# Altium schematic sheet Relays.SchDoc
size A4; SheetNumber: 4; SheetTotal: 4
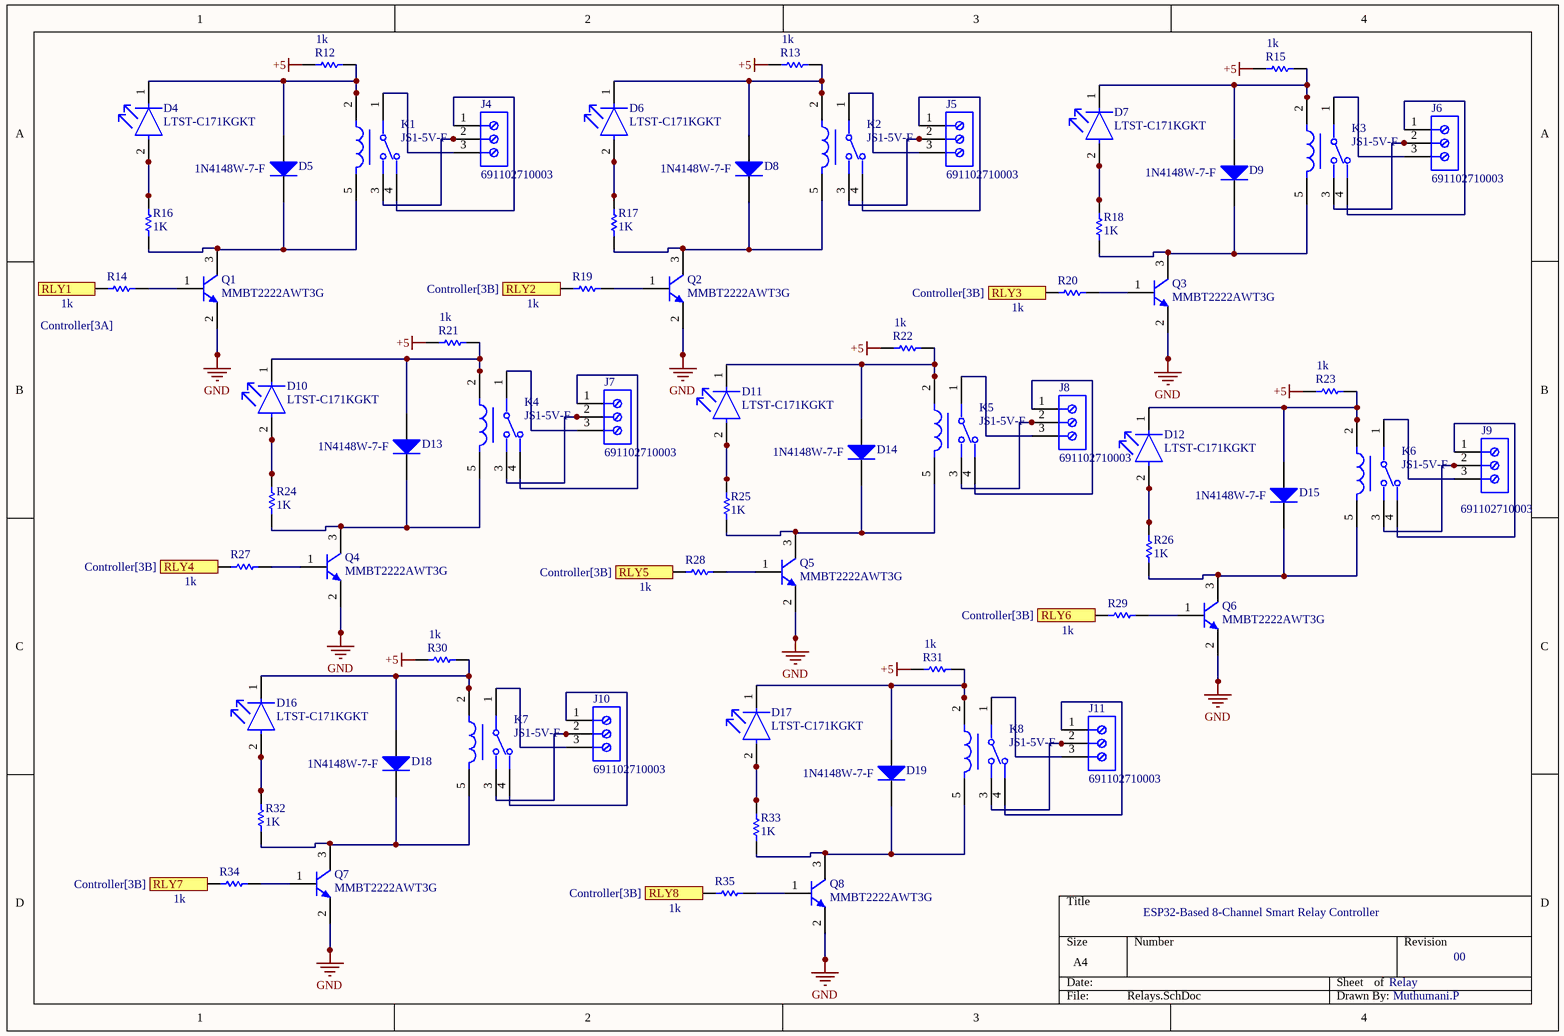
[diagram p0: Relays.SchDoc]

## Parts
D4  LTST-C171KGKT  [FP-LTST-C171KGKT-MFG]
D5  1N4148W-7-F  [DIOD-SOD123-2_V]
D6  LTST-C171KGKT  [FP-LTST-C171KGKT-MFG]
D7  LTST-C171KGKT  [FP-LTST-C171KGKT-MFG]
D8  1N4148W-7-F  [DIOD-SOD123-2_V]
D9  1N4148W-7-F  [DIOD-SOD123-2_V]
D10  LTST-C171KGKT  [FP-LTST-C171KGKT-MFG]
D11  LTST-C171KGKT  [FP-LTST-C171KGKT-MFG]
D12  LTST-C171KGKT  [FP-LTST-C171KGKT-MFG]
D13  1N4148W-7-F  [DIOD-SOD123-2_V]
D14  1N4148W-7-F  [DIOD-SOD123-2_V]
D15  1N4148W-7-F  [DIOD-SOD123-2_V]
D16  LTST-C171KGKT  [FP-LTST-C171KGKT-MFG]
D17  LTST-C171KGKT  [FP-LTST-C171KGKT-MFG]
D18  1N4148W-7-F  [DIOD-SOD123-2_V]
D19  1N4148W-7-F  [DIOD-SOD123-2_V]
J4  691102710003  [691102710003]
J5  691102710003  [691102710003]
J6  691102710003  [691102710003]
J7  691102710003  [691102710003]
J8  691102710003  [691102710003]
J9  691102710003  [691102710003]
J10  691102710003  [691102710003]
J11  691102710003  [691102710003]
K1  JS1-5V-F  [FP-JS1-5V-F-MFG]
K2  JS1-5V-F  [FP-JS1-5V-F-MFG]
K3  JS1-5V-F  [FP-JS1-5V-F-MFG]
K4  JS1-5V-F  [FP-JS1-5V-F-MFG]
K5  JS1-5V-F  [FP-JS1-5V-F-MFG]
K6  JS1-5V-F  [FP-JS1-5V-F-MFG]
K7  JS1-5V-F  [FP-JS1-5V-F-MFG]
K8  JS1-5V-F  [FP-JS1-5V-F-MFG]
Q1  MMBT2222AWT3G  [ONSC-SC-70-3-419-04_V]
Q2  MMBT2222AWT3G  [ONSC-SC-70-3-419-04_V]
Q3  MMBT2222AWT3G  [ONSC-SC-70-3-419-04_V]
Q4  MMBT2222AWT3G  [ONSC-SC-70-3-419-04_V]
Q5  MMBT2222AWT3G  [ONSC-SC-70-3-419-04_V]
Q6  MMBT2222AWT3G  [ONSC-SC-70-3-419-04_V]
Q7  MMBT2222AWT3G  [ONSC-SC-70-3-419-04_V]
Q8  MMBT2222AWT3G  [ONSC-SC-70-3-419-04_V]
R12  1k  [RESC2013X60X35ML10T20]
R13  1k  [RESC2013X60X35ML10T20]
R14  1k  [RESC2013X60X35ML10T20]
R15  1k  [RESC2013X60X35ML10T20]
R16  1K  [RESC2013X60X35ML10T20]
R17  1K  [RESC2013X60X35ML10T20]
R18  1K  [RESC2013X60X35ML10T20]
R19  1k  [RESC2013X60X35ML10T20]
R20  1k  [RESC2013X60X35ML10T20]
R21  1k  [RESC2013X60X35ML10T20]
R22  1k  [RESC2013X60X35ML10T20]
R23  1k  [RESC2013X60X35ML10T20]
R24  1K  [RESC2013X60X35ML10T20]
R25  1K  [RESC2013X60X35ML10T20]
R26  1K  [RESC2013X60X35ML10T20]
R27  1k  [RESC2013X60X35ML10T20]
R28  1k  [RESC2013X60X35ML10T20]
R29  1k  [RESC2013X60X35ML10T20]
R30  1k  [RESC2013X60X35ML10T20]
R31  1k  [RESC2013X60X35ML10T20]
R32  1K  [RESC2013X60X35ML10T20]
R33  1K  [RESC2013X60X35ML10T20]
R34  1k  [RESC2013X60X35ML10T20]
R35  1k  [RESC2013X60X35ML10T20]

## Ports
RLY1 (see Controller[3A]), RLY2 (see Controller[3B]), RLY3 (see Controller[3B]), RLY4 (see Controller[3B]), RLY5 (see Controller[3B]), RLY6 (see Controller[3B]), RLY7 (see Controller[3B]), RLY8 (see Controller[3B])

## Nets
+5: R12.2 R13.2 R15.2 R21.2 R22.2 R23.2 R30.2 R31.2
GND: Q1.2(E) Q2.2(E) Q3.2(E) Q4.2(E) Q5.2(E) Q6.2(E) Q7.2(E) Q8.2(E)
RLY1: R14.1 ; port RLY1
RLY2: R19.1 ; port RLY2
RLY3: R20.1 ; port RLY3
RLY4: R27.1 ; port RLY4
RLY5: R28.1 ; port RLY5
RLY6: R29.1 ; port RLY6
RLY7: R34.1 ; port RLY7
RLY8: R35.1 ; port RLY8
NetD4_1: D4.1(C) D5.1(A) K1.2(1_COIL) R12.1
NetD4_2: D4.2(A) R16.2
NetD5_2: D5.2(K) K1.5(2_COIL) Q1.3(C) R16.1
NetD6_1: D6.1(C) D8.1(A) K2.2(1_COIL) R13.1
NetD6_2: D6.2(A) R17.2
NetD7_1: D7.1(C) D9.1(A) K3.2(1_COIL) R15.1
NetD7_2: D7.2(A) R18.2
NetD8_2: D8.2(K) K2.5(2_COIL) Q2.3(C) R17.1
NetD9_2: D9.2(K) K3.5(2_COIL) Q3.3(C) R18.1
NetD10_1: D10.1(C) D13.1(A) K4.2(1_COIL) R21.1
NetD10_2: D10.2(A) R24.2
NetD11_1: D11.1(C) D14.1(A) K5.2(1_COIL) R22.1
NetD11_2: D11.2(A) R25.2
NetD12_1: D12.1(C) D15.1(A) K6.2(1_COIL) R23.1
NetD12_2: D12.2(A) R26.2
NetD13_2: D13.2(K) K4.5(2_COIL) Q4.3(C) R24.1
NetD14_2: D14.2(K) K5.5(2_COIL) Q5.3(C) R25.1
NetD15_2: D15.2(K) K6.5(2_COIL) Q6.3(C) R26.1
NetD16_1: D16.1(C) D18.1(A) K7.2(1_COIL) R30.1
NetD16_2: D16.2(A) R32.2
NetD17_1: D17.1(C) D19.1(A) K8.2(1_COIL) R31.1
NetD17_2: D17.2(A) R33.2
NetD18_2: D18.2(K) K7.5(2_COIL) Q7.3(C) R32.1
NetD19_2: D19.2(K) K8.5(2_COIL) Q8.3(C) R33.1
NetJ4_1: J4.1 K1.4(N.C.)
NetJ4_2: J4.2 K1.3(N.O.)
NetJ4_3: J4.3 K1.1(COM)
NetJ5_1: J5.1 K2.4(N.C.)
NetJ5_2: J5.2 K2.3(N.O.)
NetJ5_3: J5.3 K2.1(COM)
NetJ6_1: J6.1 K3.4(N.C.)
NetJ6_2: J6.2 K3.3(N.O.)
NetJ6_3: J6.3 K3.1(COM)
NetJ7_1: J7.1 K4.4(N.C.)
NetJ7_2: J7.2 K4.3(N.O.)
NetJ7_3: J7.3 K4.1(COM)
NetJ8_1: J8.1 K5.4(N.C.)
NetJ8_2: J8.2 K5.3(N.O.)
NetJ8_3: J8.3 K5.1(COM)
NetJ9_1: J9.1 K6.4(N.C.)
NetJ9_2: J9.2 K6.3(N.O.)
NetJ9_3: J9.3 K6.1(COM)
NetJ10_1: J10.1 K7.4(N.C.)
NetJ10_2: J10.2 K7.3(N.O.)
NetJ10_3: J10.3 K7.1(COM)
NetJ11_1: J11.1 K8.4(N.C.)
NetJ11_2: J11.2 K8.3(N.O.)
NetJ11_3: J11.3 K8.1(COM)
NetQ1_1: Q1.1(B) R14.2
NetQ2_1: Q2.1(B) R19.2
NetQ3_1: Q3.1(B) R20.2
NetQ4_1: Q4.1(B) R27.2
NetQ5_1: Q5.1(B) R28.2
NetQ6_1: Q6.1(B) R29.2
NetQ7_1: Q7.1(B) R34.2
NetQ8_1: Q8.1(B) R35.2

## Notes on the sheet
- ESP32-Based 8-Channel Smart Relay Controller
- Relay
- 00
- Muthumani.P

## Library data of the parts
D4 D6 D7 D10-D12 D16 D17 = CMP-22017-000037-1: LED GREEN CLEAR SMD; Number of LEDs: 1; Viewing Angle: 130°; Lens Style: Rectangular; Dominant Wavelength: 571nm; Test Current: 20mA; Luminous Intensity: 35mcd; Power Rating: 75mW; Forward Voltage: 2.4V; Forward Current: 30mA; Reverse Voltage: 5V; Lens Color: Colorless; Wavelength: 574nm; Height: 0.8mm; Illumination Color: Green; Length: 2mm; Case/Package: 0805; Number of Pins: 2; Number of Elements: 1; Package Quantity: 1; Depth: 1.25mm; Lens Transparency: Clear; Width: 1.25mm; Color: Green; Radiation Hardening: No; Mount: Surface Mount; Packaging: Tape and Reel; Case Code (Metric): 2012; Lead Free: Lead Free; Max Operating Temperature: 85°C; Min Operating Temperature: -55°C; Case Code (Imperial): 0805; Power Dissipation: 75mW
D5 D8 D9 D13-D15 D18 D19 = CMP-2000-04932-2: Fast Switching Diode, 100 V, 0.15 A, -65 to 150 degC, 2-Pin?SOD123, RoHS, Tape and Reel; Recovery Time: 4ns; Brand: DiodesIncorporated; Unit Weight: 0.000353oz; Max Surge Current: 2A; Peak Reverse Voltage: 100V; Ir - Reverse Current: 1uA; Vf - Forward Voltage: 1.25V; Configuration: Single; If - Forward Current: 0.15A; Product Category: Diodes-GeneralPurpose,Power,Switching; Operating Temperature Range: -65Cto+150C; Packaging: Reel; Manufacturer URL: http://www.diodes.com/; Maximum Operating Temperature: +150C; Height: 1.25mm; Minimum Operating Temperature: -65C; Product: SwitchingDiodes; Package URL: http://www.diodes.com/datasheets/ds18004.pdf; Type: SwitchingDiode; Package Reference: SOD123-2; Width: 1.7mm; Datasheet URL: http://www.farnell.com/datasheets/1915529.pdf; Datasheet Version: Rev. 24-2, 10/2013; Series: 1N4148; Factory Pack Quantity: 3000; Length: 2.85mm; RoHS: True; Manufacturer: DiodesIncorporated; Mounting Style: SMD/SMT; Package / Case: SOD-123
J4-J11 = CMP-1502-03259-3: 102 Series 5MM Pitch Straight, Pcb Terminal Block, Through Hole, 3 Way; Current: 15A; Wire Gauge (Max): 22AWG; Voltage: 300V; Number of Contacts: 3; Plating: Steel; Number of Levels: 1; Stripping Length: -6mm; Wire Gauge (Min): 14AWG; Pitch: 5.0038mm; Contact Plating: Tin; Wire/Cable Gauge: 22AWG; Number of Positions Per Level: 3; Min Operating Temperature: -40°C; Housing Material: Nylon; Length: 7.5mm; Contact Material: Brass; RoHS: Compliant; Max Operating Temperature: 105°C; Voltage Rating: 300V; Number of Pins: 3; Current Rating: 15A; Packaging: Box; Termination: Screw; Lead Pitch: 5mm; Color: Blue; Width: 16.2mm; Mount: Through Hole; Height: 13.4mm
K1-K8 = CMP-05606-000016-1: RELAY GEN PURPOSE SPDT 10A 5V; Manufacturer: Panasonic; Coil Type: Non-Latching; Number Of Contacts: 1; Standoff Height: 0.3mm; Switching Power: 150W; Coil Power: 360mW; Coil Current: 72mA; Coil Resistance: 69.4Ω; Lead Free: Yes; Device Class L3: Power Relays; Device Class L1: Electromechanical; Ambient Temperature Range High: +70°C; Temperature: -40°C to +70°C; Temperature Range High: +70°C; Temperature Range Low: -40°C; Manufacturer Part Number: JS1-5V-F; Coil Voltage: 5V; Switching Current: 10A; Digikey Description: RELAY GEN PURPOSE SPDT 10A 5V; Device Class L2: Relays; Ambient Temperature Range Low: -40°C; Throw Configuration: SPDT; Category: Relay; ComponentLink2URL: https://www3.panasonic.biz/ac/e_download/control/relay/power/catalog/mech_eng_js.pdf?via=ok; Package: JS1-5V-F; Octopart: https://octopart.com/js1-5v-f-panasonic-39428621; Mouser Description: JS Series 10 A SPDT 5 V Through Hole Sealed Miniature Non-Polarized Power Relay; Height: 16.8mm; ComponentLink2Description: Datasheet; RoHS: TRUE; Automotive: No
Q1-Q8 = CMP-1048-00383-1: General Purpose Transistor, NPN Silicon, 3-Pin SC70, Pb-Free, Tape and Reel; Manufacturer: On Semiconductor; IC Continuous (A): 0.6; fT Min (MHz): 300; Polarity: NPN; DatasheetVersion: Rev. 6; RoHS: TRUE; ComponentLink3Description: Package Specification; PackageDescription: 3-Pin Small Outline Transistor, Body 2 x 1.25 mm, Pitch 0.65 mm; PackageReference: SC-70-3-419-04; Mounting Technology: Surface Mount; PackageVersion: Rev. N, 11/2008; ComponentLink1Description: Manufacturer URL; PartNumber: MMBT2222AWT3G; Packing: Tape and Reel; ComponentLink3URL: http://www.onsemi.cn/pub_link/Collateral/419-04.PDF; ComponentLink2URL: http://www.onsemi.cn/pub_link/Collateral/MMBT2222AWT1-D.PDF; ComponentLink1URL: http://www.onsemi.com/; ComponentLink2Description: Datasheet
R12-R35 = CMP-2100-03671-1: Chip Resistor, 1 KOhm, +/- 1%, 125 mW, -55 to 155 degC, 0805 (2012 Metric), RoHS, Tape and Reel; Manufacturer: Yageo; Temperature Coefficient: 100ppm/degreesC; Voltage Rating (DC): 150V; Max Power Dissipation: 125mW; Resistance: 1KOhm; Number of Pins: 2; Number of Terminations: 2; Datasheet URL: http://www.yageo.com/NewPortal/yageodocoutput?fileName=/pdf/R-Chip/PYu-RC_Group_51_RoHS_L_5.pdf; Length: 0.079inch; Package Description: 2-Pin Surface Mounted Device, Body 2 x 1.25 mm; Depth: 1.25mm; Height: 0.024inch; Military Standard: Not; Case/Package: 0805; Package Reference: 0805; RoHSCompliant: true; Lead Free: LeadFree; Packaging: TapeandReel; Package Quantity: 1; Datasheet Version: Rev. 5, 10/2016; Tolerance: 1%; Min Operating Temperature: -55degC; Voltage Rating: 150V; Composition: ThickFilm; Case Code (Imperial): 0805; Power Rating: 125mW; Width: 0.049inch; Case Code (Metric): 2012; Manufacturer URL: http://www.yageo.com/; Max Operating Temperature: 155degC; REACH SVHC: Unknown; Termination: SMD/SMT